# EAGLE design synth-zodiac-cancer-led (EAGLE 9.6.2)
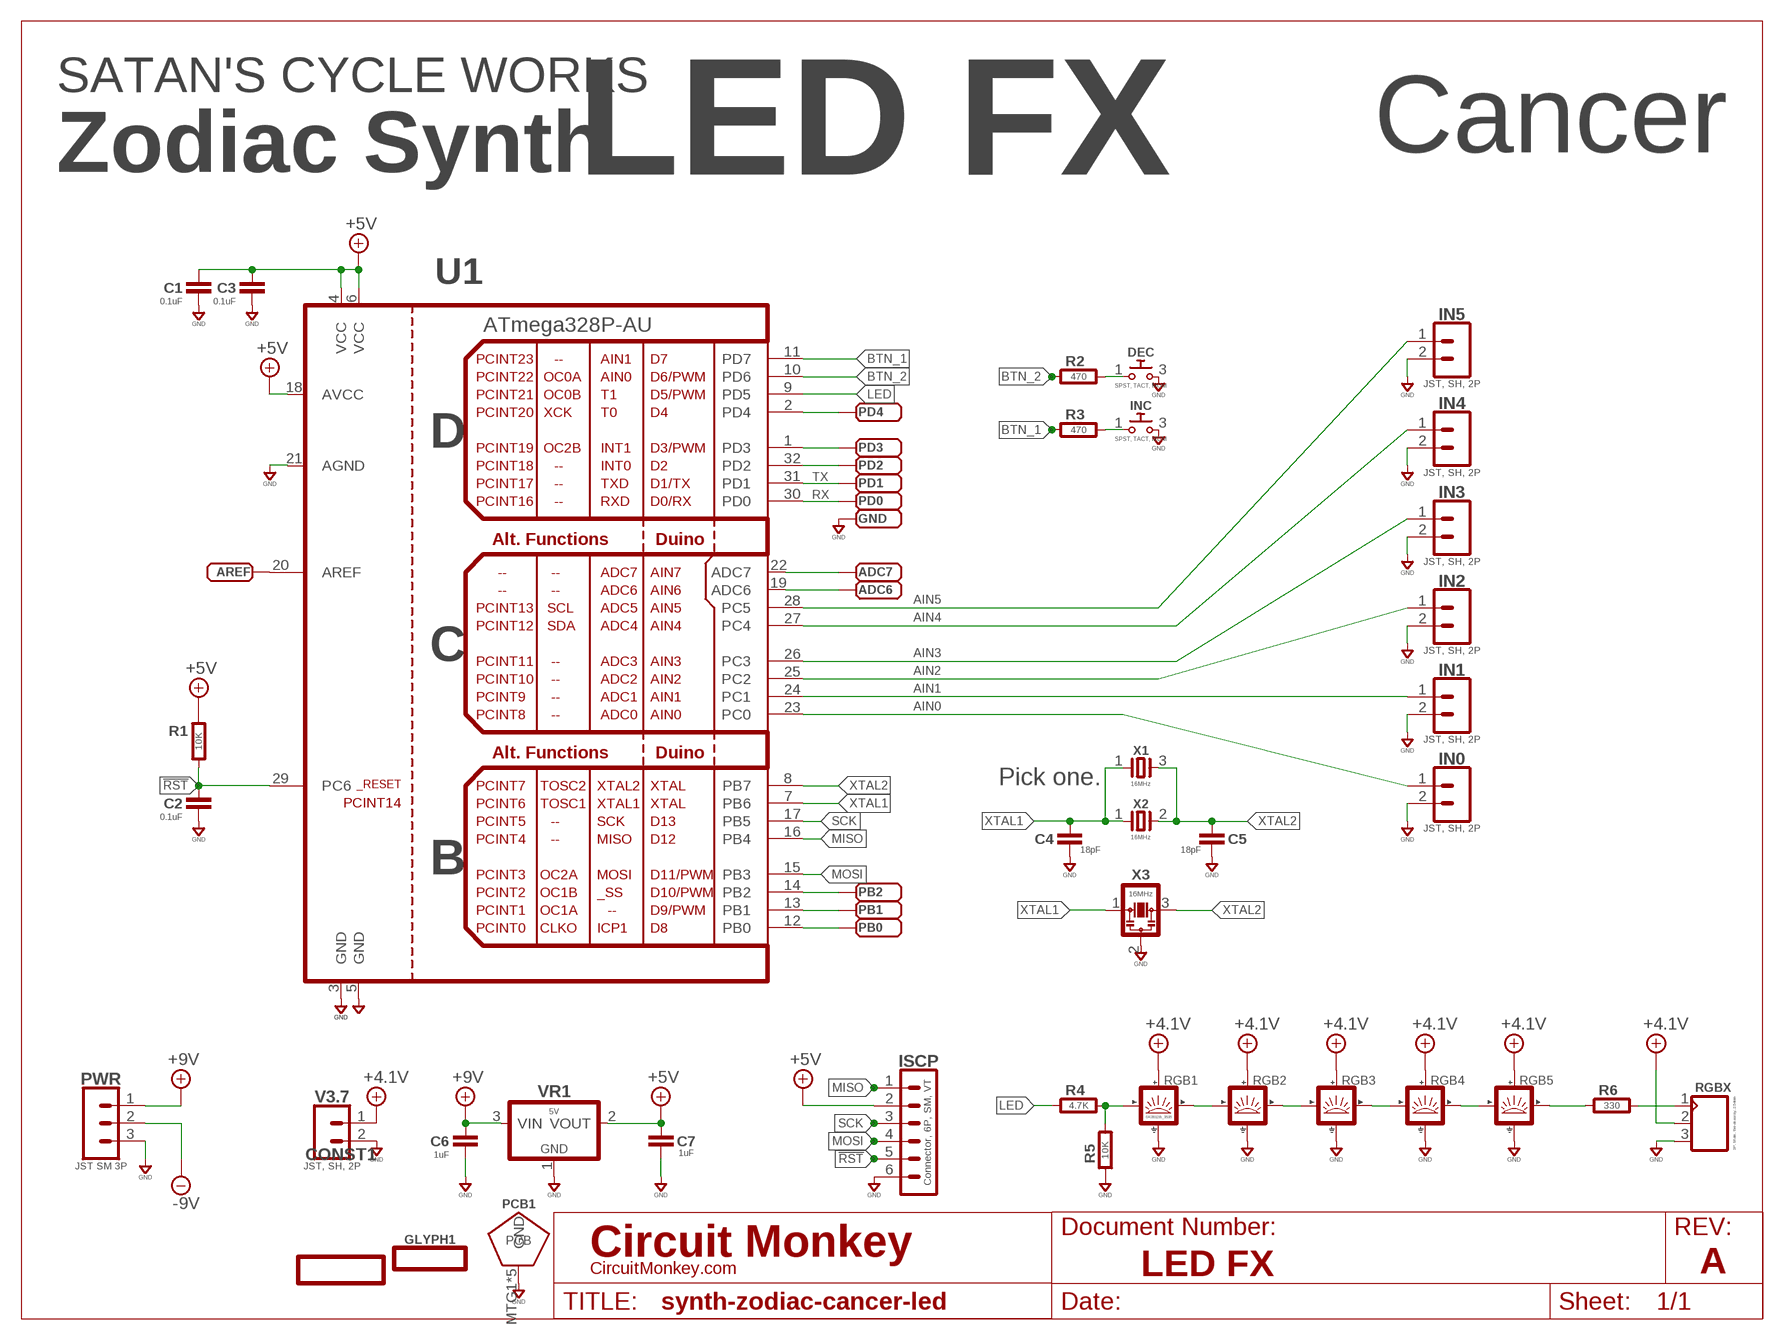
[diagram p0: schematic, sheet 1]
SHEET1 (LETTER_L-CIRCUITMONKEY): DOCUMENT_NUMBER: LED FX; REV: A

## Parts
ADC6  PADSMD-050X050  [SMD-050X050]
ADC7  PADSMD-050X050  [SMD-050X050]
AREF  PADSMD-050X050  [SMD-050X050]
C1  0.1uF  CAPACITOR0603  [0603-CAP]
C2  0.1uF  CAPACITOR0603  [0603-CAP]
C3  0.1uF  CAPACITOR0603  [0603-CAP]
C4  18pF  CAPACITOR0603  [0603-CAP]
C5  18pF  CAPACITOR0603  [0603-CAP]
C6  1uF  CAPACITOR0603  [0603-CAP]
C7  1uF  CAPACITOR0603  [0603-CAP]
CONST1  CONSTELLATION-CANCER  [CANCER-CONST]
DEC  SPST, TACT, MOM  PUSHBTN-MOMB3FS-BLIND  [B3FS-BACKMOUNT]
GLYPH1  GLYPH-CANCER  [CANCER-GLYPH]
GND  PADSMD-050X050  [SMD-050X050]
IN0  JST, SH, 2P  02P-SM-VT-SMT  [BM02B-SRSS-TB]
IN1  JST, SH, 2P  02P-SM-VT-SMT  [BM02B-SRSS-TB]
IN2  JST, SH, 2P  02P-SM-VT-SMT  [BM02B-SRSS-TB]
IN3  JST, SH, 2P  02P-SM-VT-SMT  [BM02B-SRSS-TB]
IN4  JST, SH, 2P  02P-SM-VT-SMT  [BM02B-SRSS-TB]
IN5  JST, SH, 2P  02P-SM-VT-SMT  [BM02B-SRSS-TB]
INC  SPST, TACT, MOM  PUSHBTN-MOMB3FS-BLIND  [B3FS-BACKMOUNT]
ISCP  Connector, 6P, SM, VT  06P-SM-VT-SMT  [BM06B-SRSS-TB]
PB0  PADSMD-050X050  [SMD-050X050]
PB1  PADSMD-050X050  [SMD-050X050]
PB2  PADSMD-050X050  [SMD-050X050]
PCB1  PCB FAB  PENTAGON-40R  [PENTAGON-40MM-RAD]
PD0  PADSMD-050X050  [SMD-050X050]
PD1  PADSMD-050X050  [SMD-050X050]
PD2  PADSMD-050X050  [SMD-050X050]
PD3  PADSMD-050X050  [SMD-050X050]
PD4  PADSMD-050X050  [SMD-050X050]
PWR  JST SM 3P  03P-SM-VT-SMT  [BM03B-SRSS-TB]
R1  10K  RESISTOR0603  [0603-RES]
R2  470  RESISTOR0603  [0603-RES]
R3  470  RESISTOR0603  [0603-RES]
R4  4.7K  RESISTOR0603  [0603-RES]
R5  10K  RESISTOR0603  [0603-RES]
R6  330  RESISTOR0603  [0603-RES]
RGB1  SK2812B_3535  SMART_LED3535  [SMD_3535]
RGB2  SMART_LED4020-SIDE  [SMD_4020]
RGB3  SMART_LED4020-SIDE  [SMD_4020]
RGB4  SMART_LED4020-SIDE  [SMD_4020]
RGB5  SMART_LED4020-SIDE  [SMD_4020]
RGBX  3P, Male, Breakaway, 2.54mm  CON_03X1-2.54MM-SMT-EDGE  [MA03X1-EDGE-2.54MM]
U1  ATmega328P-AU  ATMEGA328AU  [TQFP-32-08]
V3.7  JST, SH, 2P  02P-SM-VT-SMT  [BM02B-SRSS-TB]
VR1  5V  LDO-3P--5V-SOT23  [SOT-23]
X1  16MHz  2P3.2X2.5  [32X25]
X2  16MHz  2PCTS_445  [CTS_5X3]
X3  16MHz  RESONATOR-CSTE16  [CSTE-RESONATOR]

## Nets
!RST: C2.1 ISCP.5 R1.2 U1.29(PC6)
+4.1V: RGB1.4(VDD) RGB2.2(VDD) RGB3.2(VDD) RGB4.2(VDD) RGB5.2(VDD) RGBX.2 V3.7.1
+5V: C1.1 C3.1 C7.1 ISCP.2 R1.1 U1.4(VCC) U1.6(VCC) U1.18(AVCC) VR1.2(VOUT)
+9V: C6.1 PWR.1 VR1.3(VIN)
-9V: PWR.2
AIN0: IN0.1 U1.23(PC0)
AIN1: IN1.1 U1.24(PC1)
AIN2: IN2.1 U1.25(PC2)
AIN3: IN3.1 U1.26(PC3)
AIN4: IN4.1 U1.27(PC4)
AIN5: IN5.1 U1.28(PC5)
BTN_1: R3.1 U1.11(PD7)
BTN_2: R2.1 U1.10(PD6)
GND: C1.2 C2.2 C3.2 C4.2 C5.2 C6.2 C7.2 DEC.3 GND.1(PAD) IN0.2 IN1.2 IN2.2 IN3.2 IN4.2 IN5.2 INC.3 ISCP.6 PCB1.MTG1(GND) PCB1.MTG2(GND) PCB1.MTG3(GND) PCB1.MTG4(GND) PCB1.MTG5(GND) PWR.3 R5.1 RGB1.2(GND) RGB2.4(GND) RGB3.4(GND) RGB4.4(GND) RGB5.4(GND) RGBX.3 U1.3(GND) U1.5(GND) U1.21(AGND) V3.7.2 VR1.1(GND) X3.2
LED: R4.1 U1.9(PD5)
MISO: ISCP.1 U1.16(PB4)
MOSI: ISCP.4 U1.15(PB3)
N$1: INC.1 R3.2
N$2: RGB1.1(OUT) RGB2.1(IN)
N$3: RGB2.3(OUT) RGB3.1(IN)
N$4: RGB3.3(OUT) RGB4.1(IN)
N$5: RGB4.3(OUT) RGB5.1(IN)
N$6: R6.2 RGBX.1
N$7: R4.2 R5.2 RGB1.3(IN)
N$8: PD4.1(PAD) U1.2(PD4)
N$9: R6.1 RGB5.3(OUT)
N$11: DEC.1 R2.2
N$12: PD3.1(PAD) U1.1(PD3)
N$14: PD2.1(PAD) U1.32(PD2)
N$16: PB2.1(PAD) U1.14(PB2)
N$17: PB1.1(PAD) U1.13(PB1)
N$18: PB0.1(PAD) U1.12(PB0)
N$25: ADC6.1(PAD) U1.19(ADC6)
N$26: ADC7.1(PAD) U1.22(ADC7)
N$27: AREF.1(PAD) U1.20(AREF)
RX: PD0.1(PAD) U1.30(PD0)
SCK: ISCP.3 U1.17(PB5)
TX: PD1.1(PAD) U1.31(PD1)
XTAL1: C4.1 U1.7(PB6) X1.1 X2.1 X3.1
XTAL2: C5.1 U1.8(PB7) X1.3 X2.2 X3.3

## Notes on the sheet
- LED FX | Cancer
- SATAN'S CYCLE WORKS
- Zodiac Synth
- Pick one.

## Library data of the parts
ADC6 ADC7 AREF GND PB0 PB1 PB2 PD0 PD1-PD4 = con-testpoints:PAD: Solder Pad
C1-C7 = rlc:CAPACITOR: Capacitor; COST01: 0.12; COST10: 0.09; COST100: 0.05
CONST1 = circuit-monkey-zodiac:CONSTELLATION: Constellations
DEC INC = switch-smd:PUSHBTN-MOM: Pushbutton Switch; COST01: 0.15; COST10: 0.12; COST100: 0.09; MFR: CK; MPN: B3FS; MPN2: Tayda A-3961(2.3mm), A-5134(3.14mm,RA)
GLYPH1 = circuit-monkey-zodiac:GLYPH: Glyph
IN0 IN1-IN5 V3.7 = con-jst:02P: 2 pin connector; COST01: 0.45; COST10: 0.4; COST100: 0.35; MFR: JST; MPN: BMB02B-SRSS-TB
ISCP = con-jst:06P: Connector, 6P; COST01: 0.60; COST10: 0.52; COST100: 0.49; MFR: JST; MPN: BM06-SRSS-TB
PCB1 = circuit-monkey-zodiac:PENTAGON: Pentagram shaped PCB
PWR = con-jst:03P: 3 pin connector; COST01: 0.60; COST10: 0.45; COST100: 0.38; MFR: JST; MPN: BM03B-SRSS-TB
R1-R6 = rlc:RESISTOR: Resistor; COST01: 0.10; COST10: 0.05; COST100: 0.02
RGB1-RGB5 = led:SMART_LED: Smart LED SK6812 WS2812; COST01: 0.60; COST10: 0.50; COST100: 0.40
RGBX = con-headers:CON_03X1: Header, 3-pin, single row
U1 = atmel-atmega:ATMEGA328: Atmega 328P; MFR: Atmel; MPN: ATMEGA328P-AU; OC_MOUSER: 556-ATMEGA328P-AU; OC_SEEED: 310010049
VR1 = regulators:LDO-3P-: regulator 3-pin; COST01: 0.66; COST10: 0.56; COST100: 0.39; MFR: Diodes, Inc.; MPN: AP7387-50SA
X1 = xtal:2P: Crystal; MFR: Epson; MPN: FA-238 16.0000MB-K3
X2 = xtal:2P: Crystal; COST01: 0.65; COST10: 0.55; COST100: 0.45; MFR: CTS; MPN: 445C35K16M0000
X3 = xtal:RESONATOR: Resonator; COST01: 0.35; COST10: 0.30; COST100: 0.27; MFR: Murata; MPN: CSTCE16M

## Board
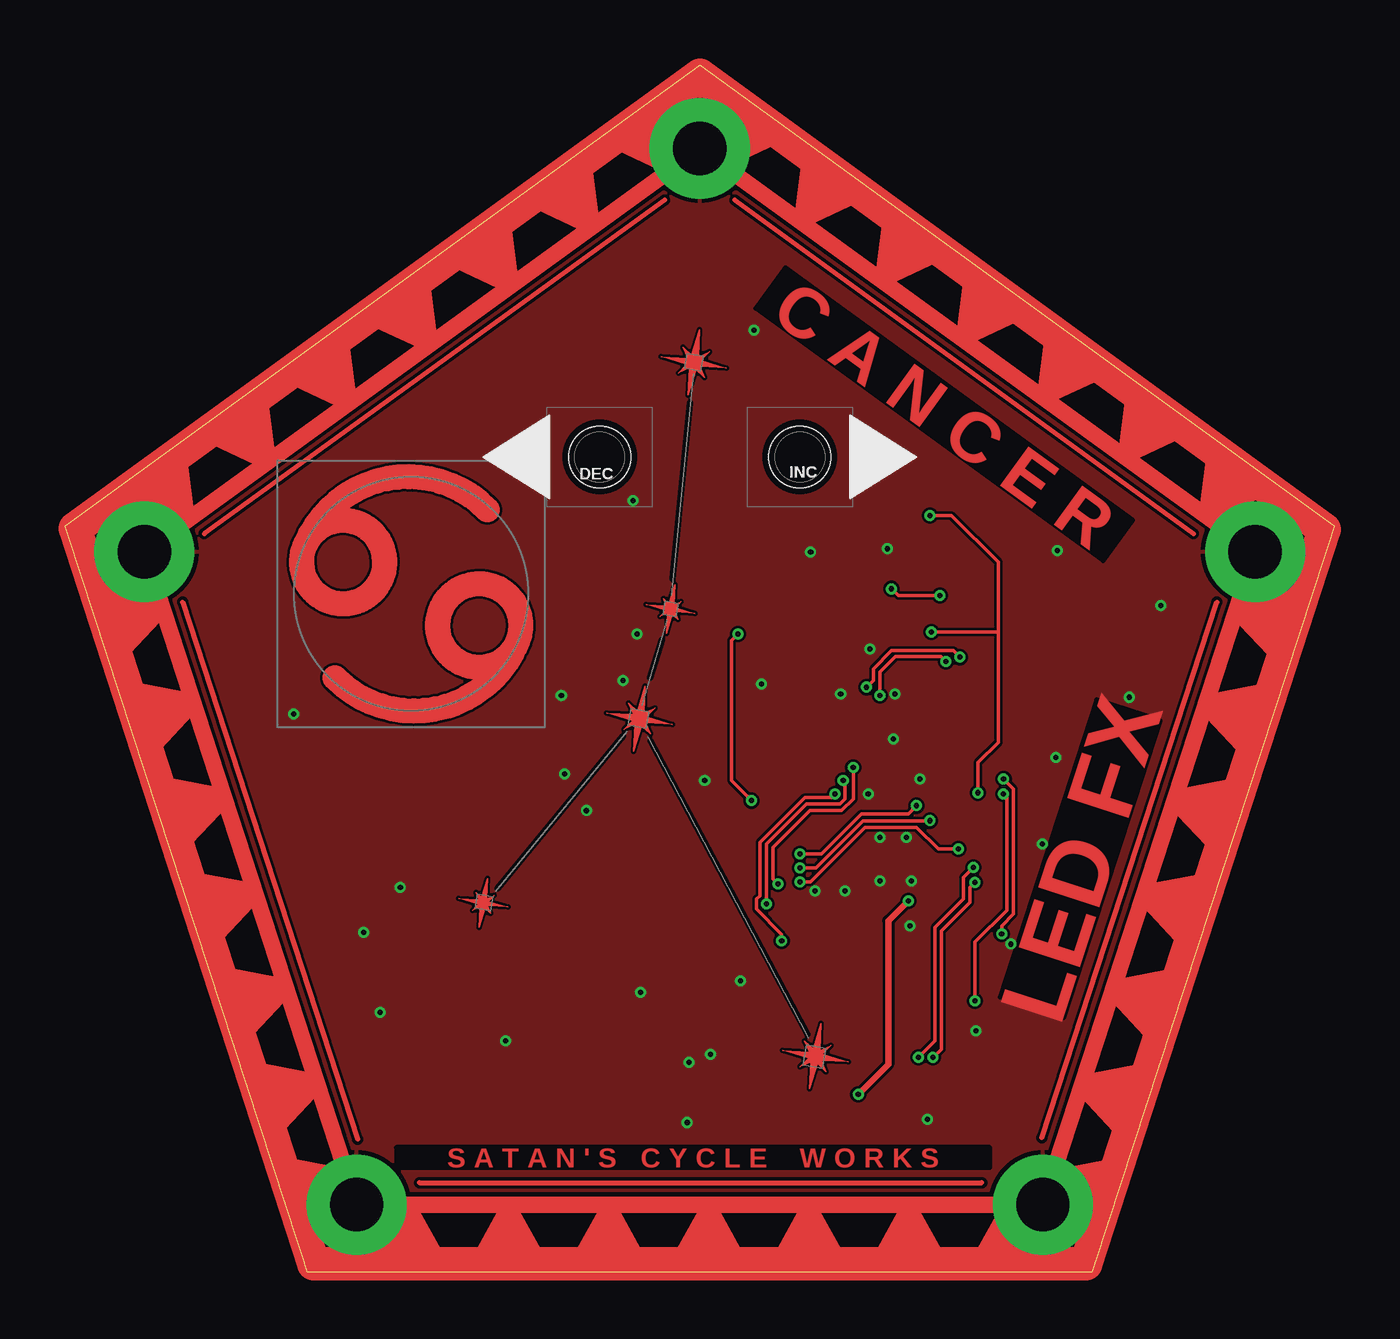
[diagram p1: board, top side]
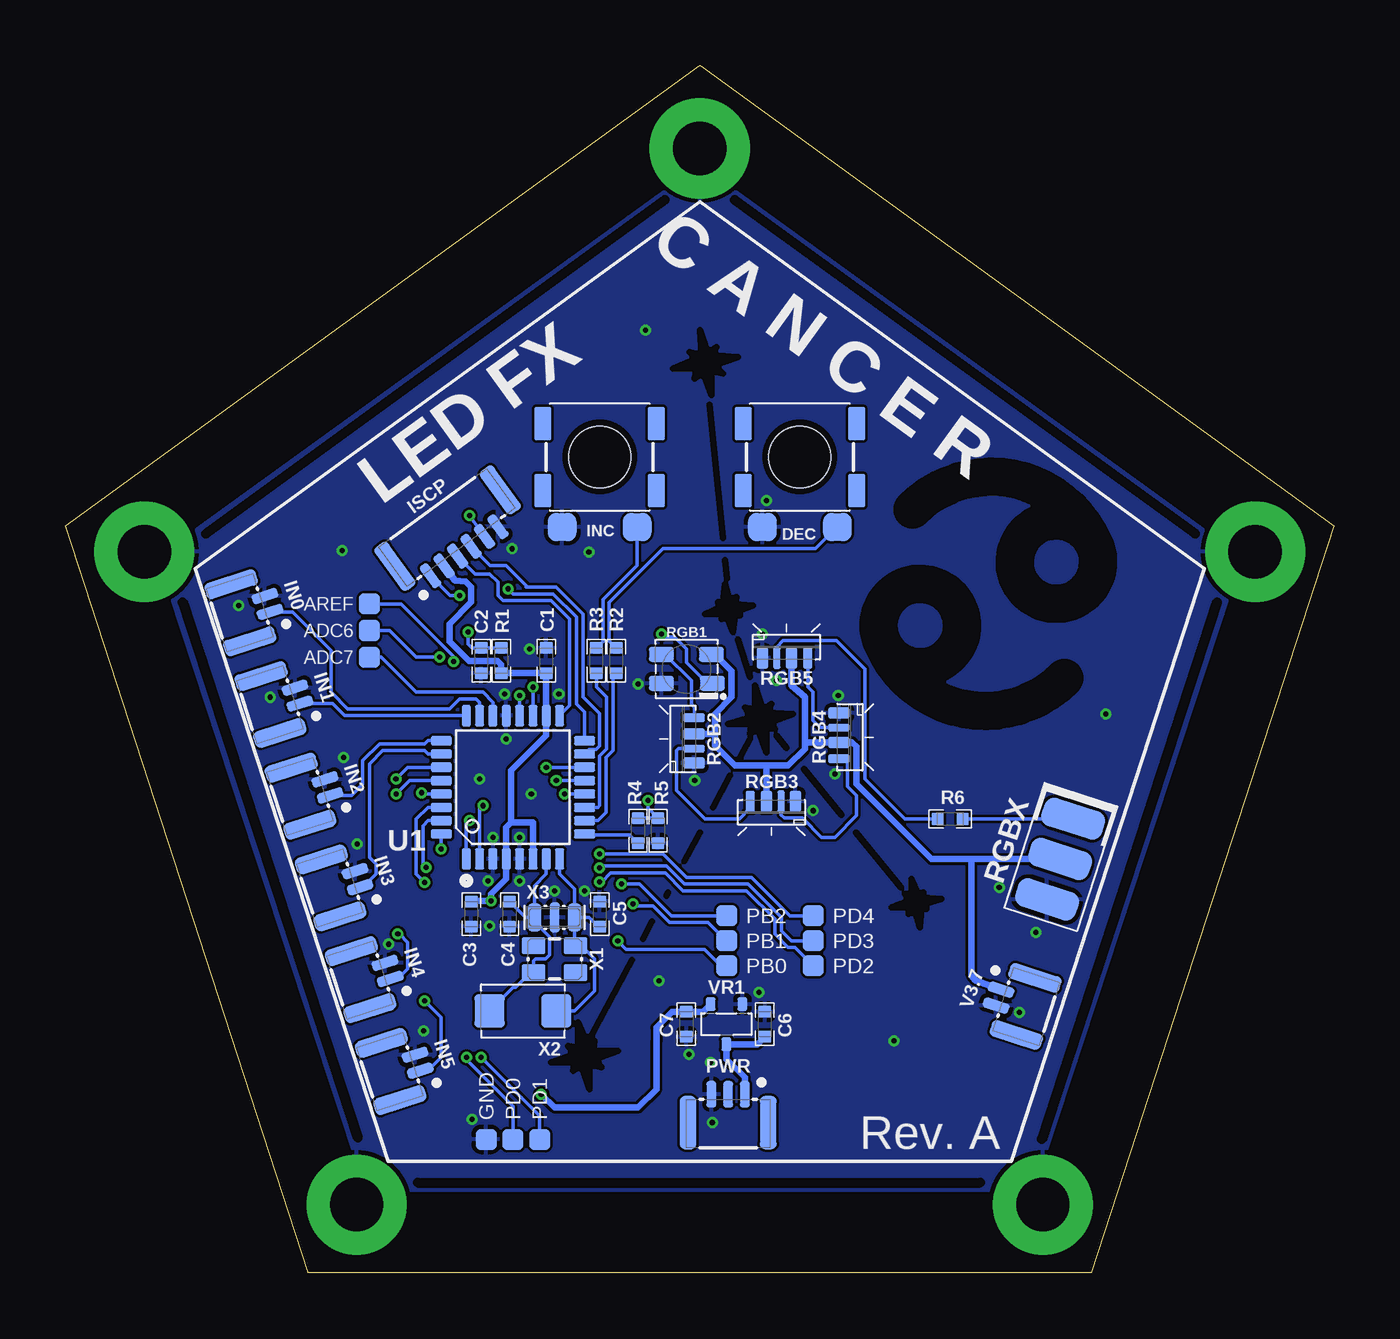
[diagram p2: board, bottom side, seen from below]

Size 76.08 x 72.36 mm. Coordinates in mm from the lower left corner, seen from the top.
Copper layers (1*16): Top 0.0356mm / dielectric 1.5011mm / Bottom 0.0356mm
Design rules "OSH-CircuitMonkey *": minimum track width 6mil, minimum drill 12mil, track to track 6mil, track to pad 6mil, pad to pad 6mil, via to via 6mil, smd to smd 6mil, copper to edge 15mil, drill to drill 6mil, minimum pad ring 7mil, minimum via ring 7mil, stop-mask expansion 3mil, vias tented up to drill 12mil, thermal gap 10mil
bRestrict: area 23.5,20.7 to 26.5,23.6; area 42.9,11 to 46.9,15; area 32.4,31.2 to 36.3,35.2; area 34.8,38.4 to 37.7,41.3; area 35.7,52.6 to 39.6,56.5; 12 lines

### Footprints (pad centres in the part's own frame; a part is rotated, then mirrored left to right if it is on the bottom)
SMD-050X050 = smd 1.27 x 1.27: 1 0.508,0
0603-CAP = smd 0.711 x 0.762: 1 -0.752,0; 2 0.752,0
B3FS-BACKMOUNT = smd 1.7 x 1.7 bottom: 1 4.2,-2.25; 3 4.2,2.25 | smd 2 x 1 bottom: MT1 -2,3.4; MT2 2,3.4; MT3 -2,-3.4; MT4 2,-3.4 | hole 3.7: 0,0
BM02B-SRSS-TB = smd 0.6 x 1.6: 1 -0.5,-0.3; 2 0.5,-0.3 | smd 1 x 3.2: MTG1 1.8,1.4; MTG2 -1.8,1.4
BM06B-SRSS-TB = smd 0.6 x 1.6: 1 -2.5,-0.3; 2 -1.5,-0.3; 3 -0.5,-0.3; 4 0.5,-0.3; 5 1.5,-0.3; 6 2.5,-0.3 | smd 1 x 3.2: MTG1 3.9,1.4; MTG2 -3.9,1.4
PENTAGON-40MM-RAD = drill 3.2 pad 6: MTG1 0,35; MTG2 33.3,10.82; MTG3 20.57,-28.32; MTG4 -20.57,-28.32; MTG5 -33.3,10.82
BM03B-SRSS-TB = smd 0.6 x 1.6: 1 -1,-0.3; 2 0,-0.3; 3 1,-0.3 | smd 1 x 3.2: MTG1 2.4,1.4; MTG2 -2.4,1.4
0603-RES = smd 0.711 x 0.762: 1 -0.752,0; 2 0.752,0
SMD_3535 = smd 1.5 x 0.9: 1 -1.5,0.875; 2 -1.5,-0.875; 3 1.55,-0.875; 4 1.5,0.875
SMD_4020 = smd 0.55 x 1.3: 1 1.275,-0.65 | smd 0.7 x 1.3: 2 0.3,-0.65; 4 -1.45,-0.65 | smd 0.45 x 1.3: 3 -0.575,-0.65
MA03X1-EDGE-2.54MM = smd 1.778 x 3.81: 1 -2.54,0; 2 0,0; 3 2.54,0
TQFP-32-08 = smd 1.27 x 0.559: 1 -4.293,2.8; 2 -4.293,2; 3 -4.293,1.2; 4 -4.293,0.4; 5 -4.293,-0.4; 6 -4.293,-1.2; 7 -4.293,-2; 8 -4.293,-2.8; 17 4.293,-2.8; 18 4.293,-2; 19 4.293,-1.2; 20 4.293,-0.4; 21 4.293,0.4; 22 4.293,1.2; 23 4.293,2; 24 4.293,2.8 | smd 0.559 x 1.27: 9 -2.8,-4.293; 10 -2,-4.293; 11 -1.2,-4.293; 12 -0.4,-4.293; 13 0.4,-4.293; 14 1.2,-4.293; 15 2,-4.293; 16 2.8,-4.293; 25 2.8,4.293; 26 2,4.293; 27 1.2,4.293; 28 0.4,4.293; 29 -0.4,4.293; 30 -1.2,4.293; 31 -2,4.293; 32 -2.8,4.293
SOT-23 = smd 0.6 x 0.8: 1 0.95,1.2; 2 -0.95,1.2; 3 0,-1.2
32X25 = smd 1.4 x 1: 1 -1.25,-0.8; 2 1.25,-0.8; 3 1.25,0.8; 4 -1.25,0.8
CTS_5X3 = smd 1.8 x 2: 1 -2,0; 2 2,0
CSTE-RESONATOR = smd 0.8 x 1.7: 1 -1.2,0; 3 1.2,0 | smd 0.6 x 1.8: 2 0,0

### Placement (x,y rotation side)
ADC6  57.34,38.46 180 bottom
ADC7  57.34,36.86 180 bottom
AREF  57.34,40.06 180 bottom
C1  47.24,36.66 90 bottom
C2  51.14,36.66 270 bottom
C3  51.74,21.46 270 bottom
C4  49.44,21.46 270 bottom
C5  44.04,21.46 90 bottom
C6  34.14,14.86 90 bottom
C7  38.84,14.86 270 bottom
CONST1  37.64,35.86 350 top
DEC  32.04,48.86 270 top
GLYPH1  20.74,40.66 0 top
GND  50.84,8.46 270 bottom
IN0  64.24,39.96 108 bottom
IN1  62.44,34.46 108 bottom
IN2  60.64,28.96 108 bottom
IN3  58.84,23.46 108 bottom
IN4  57.04,17.96 108 bottom
IN5  55.24,12.46 108 bottom
INC  44.04,48.86 270 top
ISCP  52.34,43.46 36 bottom
PB0  36.94,18.36 0 bottom
PB1  36.94,19.86 0 bottom
PB2  36.94,21.36 0 bottom
PCB1  38.04,32.36 0 top
PD0  49.24,8.46 270 bottom
PD1  47.64,8.46 270 bottom
PD2  31.74,18.36 0 bottom
PD3  31.74,19.86 0 bottom
PD4  31.74,21.36 0 bottom
PWR  36.34,10.36 180 bottom
R1  49.94,36.66 90 bottom
R2  43.04,36.66 90 bottom
R3  44.24,36.66 90 bottom
R4  41.74,26.46 90 bottom
R5  40.54,26.46 90 bottom
R6  23.04,27.16 0 bottom
RGB1  38.84,36.16 0 bottom
RGB2  39.04,31.96 90 bottom
RGB3  33.74,27.56 180 bottom
RGB4  29.04,32.06 270 bottom
RGB5  32.84,37.46 0 bottom
RGBX  16.44,24.76 252 bottom
U1  49.24,29.06 90 bottom
V3.7  19.84,16.36 252 bottom
VR1  36.44,14.86 0 bottom
X1  46.74,18.76 0 bottom
X2  48.64,15.66 0 bottom
X3  46.74,21.26 0 bottom

### Tracks (layer width: path | path; a pad name or v marks a point on that pad's centre or on a via)
!RST  (via drill 0.3)
  Top 0.2: v51.94,38.36 55.94,38.36 | 55.94,38.36 55.94,31.76 54.72,30.54 v54.72,28.74 | v51.84,45.36 53.14,45.36 55.94,42.56 55.94,38.36
  Bottom 0.2: U1.29 54.64,28.66 v54.72,28.74 | R1.2 C2.1 51.69,37.41 51.94,37.66 v51.94,38.36 | ISCP.5 51.71,45.16 v51.84,45.36
+4.1V
  Bottom 0.4: 31.74,31.76 31.74,31.36 32.74,30.36 34.14,30.36 | 31.74,31.76 31.74,34.46 32.54,35.16 RGB5.2 | 34.14,30.36 35.94,30.36 37.14,31.56 37.14,32.26 | 34.14,30.36 34.04,30.26 RGB3.2 | RGB1.4 37.14,37.04 36.14,36.04 36.14,34.46 37.14,33.46 37.14,32.26 | 31.74,31.76 RGB4.2 28.91,31.76 28.64,31.49 28.64,29.26 24.14,24.76 21.74,24.76 | RGB2.2 37.14,32.26 | 21.74,24.76 RGBX.2 | V3.7.1 21.51,17.49 21.74,17.8 21.74,24.76
+5V  (via drill 0.3)
  Top 0.4: v47.54,10.66 49.34,12.46 49.34,21.06 v50.54,22.26
  Bottom 0.4: v47.54,10.66 46.74,9.86 41.74,9.86 40.64,10.96 40.64,13.81 40.64,14.66 39.69,15.61 C7.1 37.84,15.61 VR1.2 | U1.6 48.04,26.96 49.34,26.96 | 49.34,26.96 49.64,26.66 U1.4 49.64,23.56 50.54,22.66 v50.54,22.26 51.69,22.26 C3.1 | C1.1 U1.18 47.24,32.16 49.34,30.06 49.34,26.96 | C1.1 | C1.1 R1.1 49.94,36.41 50.17,36.64 51.87,36.64 53.04,37.81 53.04,38.86 51.74,40.16 51.74,41.06 52.09,41.41 52.7,41.47 ISCP.2
+9V
  Bottom 0.4: PWR.1 35.34,11.66 36.44,12.76 VR1.3 34.59,13.66 C6.1
AIN0
  Bottom 0.2: IN0.1 63.79,39.56 62.44,39.56 60.14,37.26 60.14,34.76 59.14,33.76 53.04,33.76 52.44,34.36 51.44,34.36 51.24,34.16 U1.23
AIN1
  Bottom 0.2: IN1.1 60.06,34.08 59.34,33.35 U1.24
AIN2
  Bottom 0.2: U1.25 54.34,31.86 54.54,31.66 57.24,31.66 58.24,30.66 58.24,29.26 58.93,28.58 IN2.1
AIN3
  Bottom 0.2: U1.26 54.34,31.06 54.54,31.26 57.04,31.26 57.84,30.46 57.84,24.86 57.44,24.46 57.44,23.86 58.23,23.08 IN3.1
AIN4  (via drill 0.3)
  Top 0.2: v56.14,20.26 56.14,20.76 56.86,21.48 56.86,28.96 v56.26,29.56
  Bottom 0.2: IN4.1 56.12,17.58 55.54,18.16 55.54,19.76 56.04,20.26 v56.14,20.26 | v56.26,29.56 55.56,30.26 U1.27
AIN5  (via drill 0.3)
  Top 0.2: v54.54,16.26 54.54,19.78 56.44,21.68 56.44,28.46 v56.24,28.66
  Bottom 0.2: IN5.1 54.33,12.08 53.54,12.86 53.54,15.26 v54.54,16.26 | v56.24,28.66 55.44,29.46 U1.28
BTN_1
  Bottom 0.2: R3.1 44.24,35.06 43.64,34.46 43.64,31.36 44.05,30.95 44.05,27.96 44.15,27.86 U1.11
BTN_2
  Bottom 0.2: R2.1 43.24,35.71 43.24,31.26 43.65,30.85 43.65,27.56 44.15,27.06 U1.10
GND  (via drill 0.3)
  other vias: 50.44,26.06 48.84,26.06 48.84,23.46 50.74,23.46 49.64,31.96 49.74,34.66 50.64,20.76 44.94,22.86 46.74,22.86 31.24,27.66 29.94,29.86 29.74,34.56 33.44,35.46 38.34,29.46 34.04,46.26 48.24,37.36 41.74,35.26 51.24,29.56 48.14,28.66 46.49,34.66 49.29,43.36 44.69,43.16 65.69,39.96 63.79,34.46 59.39,30.86 58.59,25.66 56.69,19.66 54.59,14.46 51.69,9.16 37.29,8.96 37.39,12.56 34.49,16.76 38.69,13.06 18.89,15.56 17.89,20.36 20.09,23.06 34.29,38.26 40.49,17.46 26.39,13.86 13.69,33.46 41.29,56.46 59.49,43.26
  pour Top (rank 5): 18.04,4.86 58.04,4.86 70.54,42.86 38.04,66.36 5.54,42.86
  pour Bottom (rank 5): 18.04,4.86 58.04,4.86 70.54,42.86 38.04,66.36 5.54,42.86
LED
  Bottom 0.2: U1.9 44.9,26.21 42.25,26.21 R4.1
MISO  (via drill 0.3)
  Top 0.2: v49.54,40.96 49.94,40.56 v52.44,40.56
  Bottom 0.2: U1.16 44.95,33.57 45.44,34.06 45.44,39.26 46.85,40.66 49.24,40.66 v49.54,40.96 | v52.44,40.56 53,40.56 ISCP.1
MOSI
  Bottom 0.2: U1.15 44.68,31.33 44.26,31.33 44.06,31.53 44.06,33.48 45.04,34.46 45.04,39.46 46.64,41.06 48.44,41.06 48.44,41.16 49.64,42.36 50.61,42.36 ISCP.4
N$1
  Bottom 0.2: INC.1 41.79,42.36 43.84,40.31 43.84,37.81 R3.2
N$2
  Bottom 0.2: RGB1.1 40.12,37.04 38.54,35.46 38.54,34.06 38.34,33.86 38.34,33.29 RGB2.1
N$3
  Bottom 0.2: RGB2.3 39.32,31.39 39.44,31.26 39.44,28.86 37.74,27.16 35.67,27.16 35.02,27.81 RGB3.1
N$4
  Bottom 0.2: RGB3.3 33.17,27.41 32.97,27.21 31.89,27.21 30.74,26.06 29.94,26.06 28.64,27.36 28.64,28.56 29.19,29.11 29.19,30.59 29.39,30.79 RGB4.1
N$5
  Bottom 0.2: RGB5.1 31.57,35.09 31.24,34.76 31.24,33.06 30.82,32.64 RGB4.3
N$6
  Bottom 0.2: R6.2 22.27,27.18 RGBX.1
N$7  (via drill 0.3)
  Top 0.2: v40.34,38.26 39.94,37.86 39.94,29.46 v41.14,28.26
  Bottom 0.2: RGB1.3 37.59,35.29 38.84,36.54 38.84,37.36 39.54,38.06 40.14,38.06 v40.34,38.26 | v41.14,28.26 41.14,27.81 R5.2 R4.2
N$8  (via drill 0.3)
  Top 0.2: v44.04,25.06 45.34,25.06 47.74,27.46 50.54,27.46 v51.04,27.96
  Bottom 0.2: PD4.1 32.64,21.36 34.94,23.66 38.84,23.66 40.24,25.06 v44.04,25.06 | U1.2 51.24,27.76 v51.04,27.96
N$9
  Bottom 0.2: R6.1 25.74,27.16 28.14,29.56 28.14,36.16 29.84,37.86 33.04,37.86 33.42,37.49 RGB5.3
N$11
  Bottom 0.2: R2.2 43.47,37.84 43.47,40.14 40.24,43.36 31.09,43.36 DEC.1
N$12  (via drill 0.3)
  Top 0.2: v51.84,27.06 47.84,27.06 45.02,24.23 v44.04,24.23
  Bottom 0.2: PD3.1 32.54,19.86 33.14,20.46 33.14,21.26 35.14,23.26 38.94,23.26 40.04,24.36 43.92,24.36 v44.04,24.23 | v51.84,27.06 52.04,26.86 U1.1
N$14  (via drill 0.3)
  Top 0.2: v53.54,25.36 52.34,25.36 51.04,26.66 47.94,26.66 44.68,23.4 v44.04,23.4
  Bottom 0.2: PD2.1 32.33,19.46 32.74,19.46 33.54,20.26 33.54,21.16 35.24,22.86 39.04,22.86 40.1,23.91 43.38,23.91 43.89,23.4 v44.04,23.4 | v53.54,25.36 U1.32
N$16  (via drill 0.3)
  Top 0.2: v47.24,30.26 47.24,28.36 46.54,27.66 44.64,27.66 42.44,25.46 42.44,23.56 v42.74,23.26
  Bottom 0.2: PB2.1 39.74,21.36 41.64,23.26 v42.74,23.26 | U1.14 v47.24,30.26
N$17  (via drill 0.3)
  Top 0.2: v46.64,29.46 46.74,29.36 46.74,28.36 46.44,28.06 44.44,28.06 42.04,25.66 v42.04,22.06
  Bottom 0.2: PB1.1 37.54,20.96 39.84,20.96 40.84,21.96 41.94,21.96 v42.04,22.06 | U1.13 v46.64,29.46
N$18  (via drill 0.3)
  Top 0.2: v46.14,28.66 45.94,28.46 44.34,28.46 41.64,25.76 41.64,22.56 41.44,22.36 41.44,21.76 42.95,20.25 v42.95,19.85
  Bottom 0.2: PB0.1 36.77,18.36 37.75,19.35 42.45,19.35 v42.95,19.85 | U1.12 v46.14,28.66
N$25  (via drill 0.3)
  Top 0.2: v48.04,35.06 48.44,35.46 48.44,36.16 49.54,37.26 53.24,37.26 v53.64,36.86
  Bottom 0.2: U1.19 v48.04,35.06 | v53.64,36.86 55.04,36.86 56.64,38.46 ADC6.1
N$26
  Bottom 0.2: ADC7.1 57.14,36.86 55.04,34.76 51.04,34.76 50.44,34.16 U1.22
N$27  (via drill 0.3)
  Top 0.2: v48.84,34.56 48.84,35.96 49.79,36.9 52.5,36.9 v52.8,36.6
  Bottom 0.2: U1.20 v48.84,34.56 | v52.8,36.6 52.8,36.9 55.95,40.06 AREF.1
RX  (via drill 0.3)
  Top 0.2: v52.02,12.86 52.52,13.36 52.52,20.44 54.24,22.16 54.24,23.06 v54.54,23.36
  Bottom 0.2: v52.02,12.86 52.02,12.72 49.24,9.94 PD0.1 | U1.30 54.34,27.86 55.04,27.16 55.04,23.86 v54.54,23.36
SCK
  Bottom 0.2: U1.17 45.84,33.95 45.84,39.16 46.94,40.26 49.84,40.26 50.14,40.57 50.14,41.36 50.64,41.86 51.51,41.86 ISCP.3
TX  (via drill 0.3)
  Top 0.2: v51.14,12.86 52.14,13.86 52.14,20.66 53.84,22.36 53.84,23.66 v54.44,24.26
  Bottom 0.2: PD1.1 47.64,9.36 v51.14,12.86 | U1.31 54.34,27.06 54.64,26.75 54.64,24.46 v54.44,24.26
XTAL1
  Bottom 0.2: U1.7 47.24,23.86 47.94,23.16 X3.1 | X3.1 47.94,21.01 47.04,20.11 47.04,19.01 47.29,18.76 47.89,18.76 47.99,18.66 X1.1 48.19,17.96 49.09,17.06 49.24,17.06 X2.1 | C4.1 48.49,21.26 X3.1
XTAL2
  Bottom 0.2: U1.8 46.44,23.87 45.54,22.97 X3.3 | X3.3 45.54,19.61 X1.3 45.14,19.56 44.34,18.76 44.34,16.86 45.54,15.66 X2.2 | C5.1 44.14,20.71 44.69,21.26 X3.3

### Text on the board
Top: C A N C E R | LED FX | S A T A N ' S C Y C L E W O R K S
bPlace: C A N C E R | LED FX | Rev. A
tStop: C A N C E R | LED FX | S A T A N ' S C Y C L E W O R K S